# EAGLE design power-reset board v0.2 (EAGLE 7.1.0)
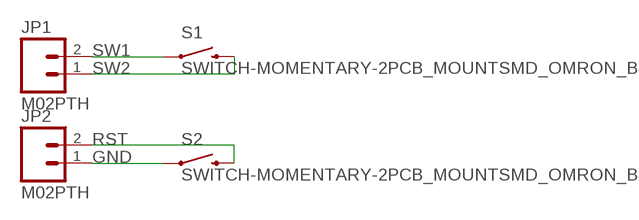
[diagram p0: schematic, sheet 1]

## Parts
JP1  M02PTH  [1X02]
JP2  M02PTH  [1X02]
S1  SWITCH-MOMENTARY-2PCB_MOUNTSMD_OMRON_B3S_100X  [TACTILE_SWITCH_LARGE]
S2  SWITCH-MOMENTARY-2PCB_MOUNTSMD_OMRON_B3S_100X  [TACTILE_SWITCH_LARGE]

## Nets
GND: JP2.1 S2.1
RST: JP2.2 S2.3
SW1: JP1.2 S1.1
SW2: JP1.1 S1.3

## Library data of the parts
JP1 JP2 = SparkFun-Connectors:M02: Standard 2-pin 0.1" header. Use with - straight break away headers ( PRT-00116) - right angle break away headers (PRT-00553) - swiss pins (PRT-00743) - machine pins (PRT-00117) - female headers (PRT-00115) Molex polarized connector foot print use with: PRT-08233 with associated crimp pins and housings. 2.54_SCREWTERM for use with PRT-10571. 3.5mm Screw Terminal footprints for PRT-08084 5mm Screw Terminal footprints for use with PRT-08432
S1 S2 = SparkFun-Electromechanical:SWITCH-MOMENTARY-2: Various NO switches- pushbuttons, reed, etc

## Board
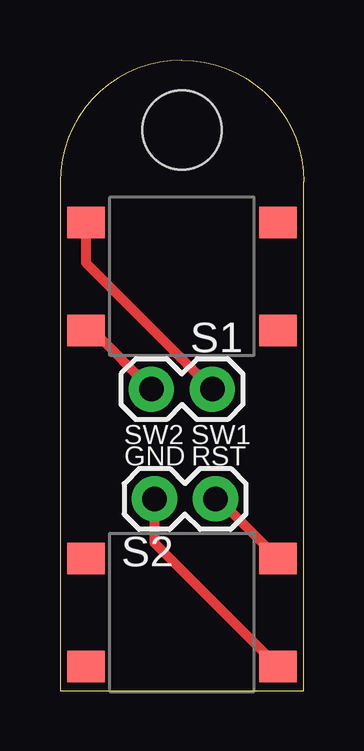
[diagram p1: board, top side]

Size 10.16 x 26.29 mm. Coordinates in mm from the lower left corner, seen from the top.
Outline: 0,0 10.16,0 10.16,21.21 arc90 5.08,26.29 arc90 0,21.21 0,0
Copper layers (1*16): Top 0.035mm / dielectric 1.5mm / Bottom 0.035mm
Design rules "SparkFun": minimum track width 8mil, minimum drill 20mil, track to track 8mil, track to pad 8mil, pad to pad 8mil, via to via 8mil, smd to smd 8mil, copper to edge 10mil, drill to drill 8mil, minimum pad ring 12mil, minimum via ring 10mil, stop-mask expansion 4mil, vias tented up to drill 25mil, thermal gap 10mil

### Footprints (pad centres in the part's own frame; a part is rotated, then mirrored left to right if it is on the bottom)
1X02 = drill 1.016 pad 1.88: 1 0,0; 2 2.54,0
TACTILE_SWITCH_LARGE = smd 1.55 x 1.3: 1 4,-2.25; 2 -4,-2.25; 3 4,2.25; 4 -4,2.25
STAND-OFF = hole 3.302: 0,0

### Placement (x,y rotation side)
JP1  3.81,12.57 0 top
JP2  3.94,8 0 top
S1  5.08,17.27 180 top
S2  5.08,3.27 0 top
U$1  [STAND-OFF]  5.08,23.37 0 top

### Tracks (layer width: path | path; a pad name or v marks a point on that pad's centre or on a via)
GND
  Top 0.406: JP2.1 3.94,6.17 S2.1
RST
  Top 0.406: JP2.2 6.6,8 S2.3
SW1
  Top 0.406: S1.1 1.08,17.84 JP1.2
SW2
  Top 0.406: S1.3 1.36,15.02 JP1.1

### Text on the board
tPlace: SW2 | SW1 | GND | RST
bNames: SW2 | SW1 | GND | RST
tDocu: buttons need to be 14mm apart center-center